# Altium schematic sheet RT1064_Device.SchDoc
size A4; SheetNumber: 2; SheetTotal: 4
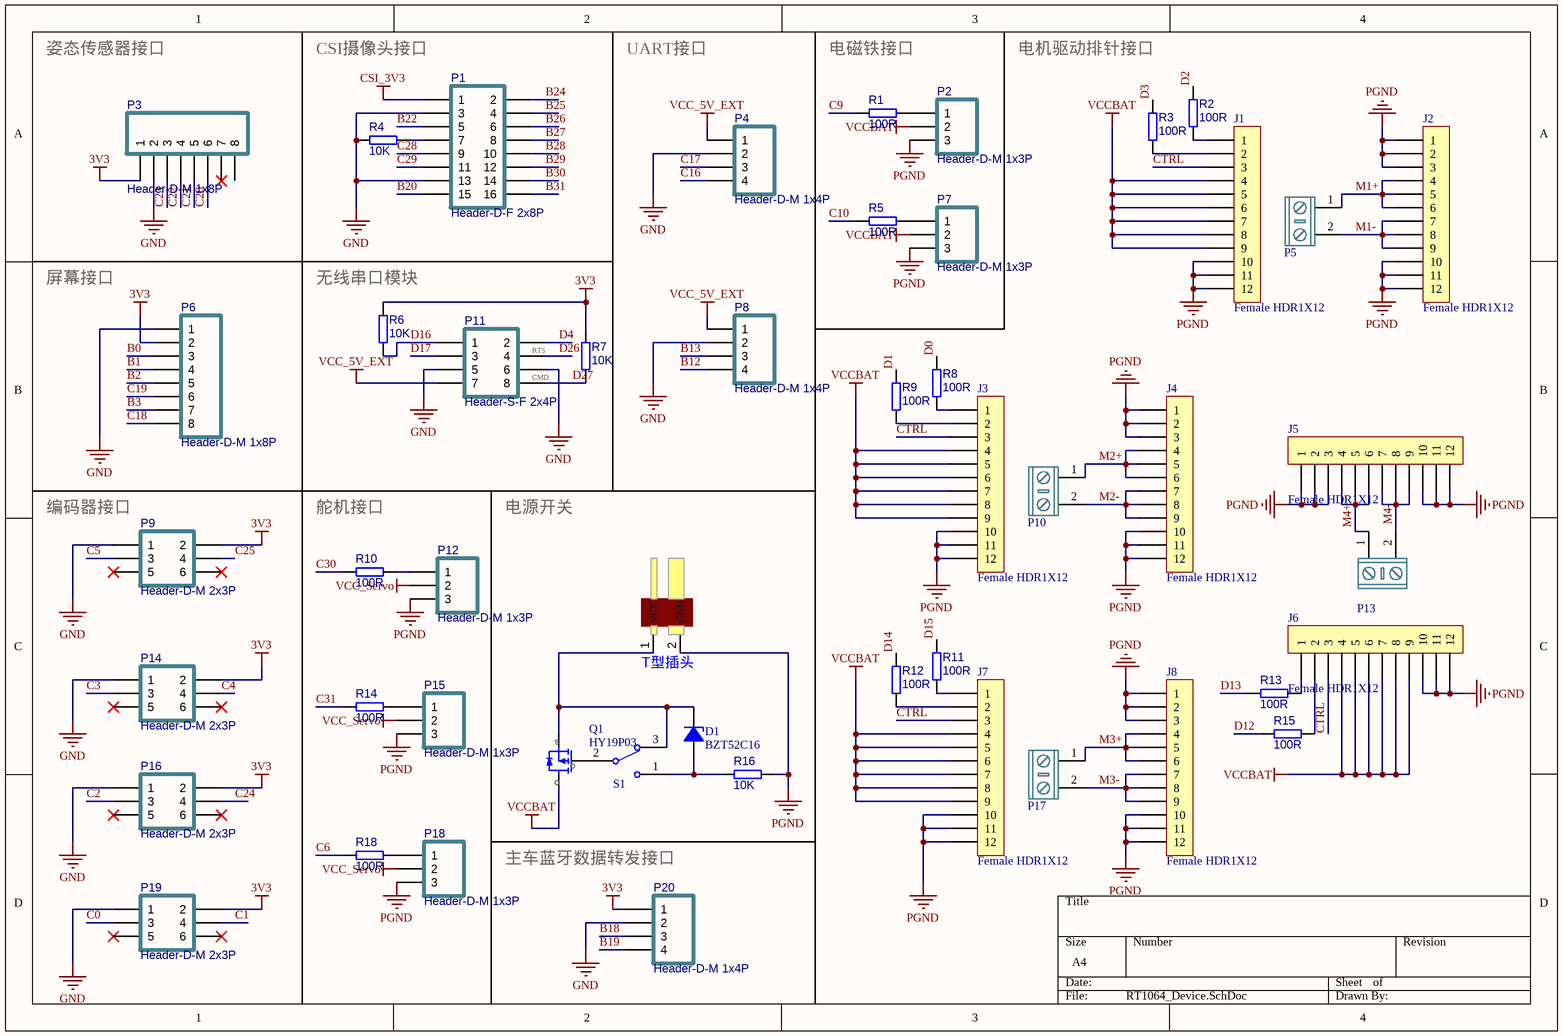
[diagram p0: RT1064_Device.SchDoc]

## Parts
D1  BZT52C16  [SOD-123-L]
DCIN1  T型插头  [PCBComponent_1]
J1  Female HDR1X12  [Fe-HDR1X12/2.54-S]
J2  Female HDR1X12  [Fe-HDR1X12/2.54-S]
J3  Female HDR1X12  [Fe-HDR1X12/2.54-S]
J4  Female HDR1X12  [Fe-HDR1X12/2.54-S]
J5  Female HDR1X12  [Fe-HDR1X12/2.54-S]
J6  Female HDR1X12  [Fe-HDR1X12/2.54-S]
J7  Female HDR1X12  [Fe-HDR1X12/2.54-S]
J8  Female HDR1X12  [Fe-HDR1X12/2.54-S]
P1  Header-D-F 2x8P  [Cam_HDR2X8-F-SMT]
P2  Header-D-M 1x3P  [HDR1X3-M]
P3  Header-D-M 1x8P  [Fe-HDR1X8/2.54-S]
P4  Header-D-M 1x4P  [PH2.0W-4P]
P5  KF/WJ/DG 30x connecter  [XT30-M]  (value not drawn)
P6  Header-D-M 1x8P  [Fe-HDR1X8/2.54-S]
P7  Header-D-M 1x3P  [HDR1X3-M]
P8  Header-D-M 1x4P  [PH2.0W-4P]
P9  Header-D-M 2x3P  [IDC2.54-6P]
P10  KF/WJ/DG 30x connecter  [XT30-M]  (value not drawn)
P11  Header-S-F 2x4P  [HDR2X4-F-SMT]
P12  Header-D-M 1x3P  [Fe-HDR1X3/2.54-S]
P13  KF/WJ/DG 30x connecter  [XT30-M]  (value not drawn)
P14  Header-D-M 2x3P  [IDC2.54-6P]
P15  Header-D-M 1x3P  [Fe-HDR1X3/2.54-S]
P16  Header-D-M 2x3P  [IDC2.54-6P]
P17  KF/WJ/DG 30x connecter  [XT30-M]  (value not drawn)
P18  Header-D-M 1x3P  [Fe-HDR1X3/2.54-S]
P19  Header-D-M 2x3P  [IDC2.54-6P]
P20  Header-D-M 1x4P  [HDR1X4-M]
Q1  HY19P03  [TO-252AA]
R1  value 100R  [RESC1608[0603]S-L]  (hidden comment: 100R ±1%)
R2  value 100R  [RESC1608[0603]S-L]  (hidden comment: 100R ±1%)
R3  value 100R  [RESC1608[0603]S-L]  (hidden comment: 100R ±1%)
R4  value 10K  [RESC1608[0603]S-L]  (hidden comment: 10K ±1%)
R5  value 100R  [RESC1608[0603]S-L]  (hidden comment: 100R ±1%)
R6  value 10K  [RESC1608[0603]S-L]  (hidden comment: 10K ±1%)
R7  value 10K  [RESC1608[0603]S-L]  (hidden comment: 10K ±1%)
R8  value 100R  [RESC1608[0603]S-L]  (hidden comment: 100R ±1%)
R9  value 100R  [RESC1608[0603]S-L]  (hidden comment: 100R ±1%)
R10  value 100R  [RESC1608[0603]S-L]  (hidden comment: 100R ±1%)
R11  value 100R  [RESC1608[0603]S-L]  (hidden comment: 100R ±1%)
R12  value 100R  [RESC1608[0603]S-L]  (hidden comment: 100R ±1%)
R13  value 100R  [RESC1608[0603]S-L]  (hidden comment: 100R ±1%)
R14  value 100R  [RESC1608[0603]S-L]  (hidden comment: 100R ±1%)
R15  value 100R  [RESC1608[0603]S-L]  (hidden comment: 100R ±1%)
R16  value 10K  [RESC1608[0603]S-L]  (hidden comment: 10K ±1%)
R18  value 100R  [RESC1608[0603]S-L]  (hidden comment: 100R ±1%)
S1  SW-SPDT  [SS-12F23]  (value not drawn)

## Nets
3V3: P3.1 P6.2 P9.2 P14.2 P16.2 P19.2 P20.1 R6.2 R7.2
CSI_3V3: P1.1
GND: P1.3 P1.13 P3.2 P4.2 P6.1 P8.2 P9.1 P11.5 P11.6 P14.1 P16.1 P19.1 P20.2 R4.2
PGND: DCIN1.2(GND) J1.10 J1.11 J1.12 J2.1 J2.2 J2.3 J2.10 J2.11 J2.12 J3.10 J3.11 J3.12 J4.1 J4.2 J4.3 J4.10 J4.11 J4.12 J5.1 J5.2 J5.3 J5.10 J5.11 J5.12 J6.10 J6.11 J6.12 J7.10 J7.11 J7.12 J8.1 J8.2 J8.3 J8.10 J8.11 J8.12 P2.3 P7.3 P12.3 P15.3 P18.3 R16.1
VCC_5V_EXT: P4.1 P8.1 P11.7
VCC_Servo: P12.2 P15.2 P18.2
VCCBAT: J1.4 J1.5 J1.6 J1.7 J1.8 J1.9 J3.4 J3.5 J3.6 J3.7 J3.8 J3.9 J6.4 J6.5 J6.6 J6.7 J6.8 J6.9 J7.4 J7.5 J7.6 J7.7 J7.8 J7.9 P2.2 P7.2 Q1.1(D)
B0: P6.3
B1: P6.4
B2: P6.5
B3: P6.7
B12: P8.4
B13: P8.3
B18: P20.3
B19: P20.4
B20: P1.15
B22: P1.5
B24: P1.2
B25: P1.4
B26: P1.6
B27: P1.8
B28: P1.10
B29: P1.12
B30: P1.14
B31: P1.16
C0: P19.3
C1: P19.4
C2: P16.3
C3: P14.3
C4: P14.4
C5: P9.3
C6: R18.2
C9: R1.2
C10: R5.2
C16: P4.4
C17: P4.3
C18: P6.8
C19: P6.6
C20: P3.6
C21: P3.5
C22: P3.4
C23: P3.3
C24: P16.4
C25: P9.4
C28: P1.9
C29: P1.11
C30: R10.2
C31: R14.2
CTRL: J1.3 J3.3 J6.3 J7.3
D0: R8.1
D1: R9.1
D2: R2.1
D3: R3.1
D4: P11.2
D12: R15.1
D13: R13.1
D14: R12.1
D15: R11.1
D16: P11.1 R6.1
D17: P11.3
D26: P11.4
D27: P11.8 R7.1
M1+: J2.4 J2.5 J2.6 P5.1
M1-: J2.7 J2.8 J2.9 P5.2
M2+: J4.4 J4.5 J4.6 P10.1
M2-: J4.7 J4.8 J4.9 P10.2
M3+: J8.4 J8.5 J8.6 P17.1
M3-: J8.7 J8.8 J8.9 P17.2
M4+: J5.4 J5.5 J5.6 P13.1
M4-: J5.7 J5.8 J5.9 P13.2
NetD1_A: D1.A R16.2 S1.1
NetD1_K: D1.K DCIN1.1(VCC) Q1.3(S) S1.3
NetJ1_1: J1.1 R2.2
NetJ1_2: J1.2 R3.2
NetJ3_1: J3.1 R8.2
NetJ3_2: J3.2 R9.2
NetJ6_1: J6.1 R13.2
NetJ6_2: J6.2 R15.2
NetJ7_1: J7.1 R11.2
NetJ7_2: J7.2 R12.2
NetP1_7: P1.7 R4.1
NetP2_1: P2.1 R1.1
NetP7_1: P7.1 R5.1
NetP12_1: P12.1 R10.1
NetP15_1: P15.1 R14.1
NetP18_1: P18.1 R18.1
NetQ1_2: Q1.2(G) S1.2

Not connected (* = marked no-connect by the designer): P3 7* 8; P9 5* 6*; P14 5* 6*; P16 5* 6*; P19 5* 6*

## Notes on the sheet
- 姿态传感器接口
- CSI摄像头接口
- UART接口
- 电磁铁接口
- 电机驱动排针接口
- 屏幕接口
- (near R6) 无线串口模块
- (near P11) RTS
- (near P11) CMD
- 编码器接口
- 舵机接口
- 电源开关
- 主车蓝牙数据转发接口

## Library data of the parts
D1 = Diode Zen: 稳压二极管 齐纳二极管  Zener Diode; Published: 8-Jun-2000; Revision: July-2002: Re-released for DXP Platform.; Publisher: Altium Limited; Price(RMB): 0.000
DCIN1 = T_Header
J1-J8 = Female HDR1X12: 1X12Pin,直插排母
P1 = Header-D-F 2x8P: 2x8pin, 直插, 双排座; Revision: V1.0; Value: Header-D-F 2x8P
P2 P7 P12 P15 P18 = Header-D-M 1x3P: 1x3pin, 直插, 排针; Revision: V1.0; Value: Header-D-M 1x3P
P3 P6 = Header-D-M 1x8P: 1x8pin, 直插, 排针; Revision: V1.0; Value: Header-D-M 1x8P
P4 P8 P20 = Header-D-M 1x4P: 1x4pin, 直插, 排针; Revision: V1.0; Value: Header-D-M 1x4P
P5 P10 P13 P17 = KF/WJ/DG 30x: 接线端子 2Pin
P9 P14 P16 P19 = Header-S-M 2x3P: 2x3pin, 贴片, 双排针; Revision: V1.0; Value: Header-D-M 2x3P
P11 = Header-S-F 2x4P: 2x4pin, 贴片, 双排座; Revision: V1.0; Value: Header-S-F 2x4P
Q1 = HY19P03: HY19P03 P-Channel MOSFET
R1-R16 R18 = Res-Chip: 贴片电阻; Power: 1/8W; Revision: V1.0; Tolerance: ±1%
S1 = SW-SPDT: 单刀双掷开关 3脚船型、钮子、拨动开关 SPDT Subminiature Toggle Switch; Published: 24-Mar-1999; Publisher: Altium Limited; Price(RMB): 0.000